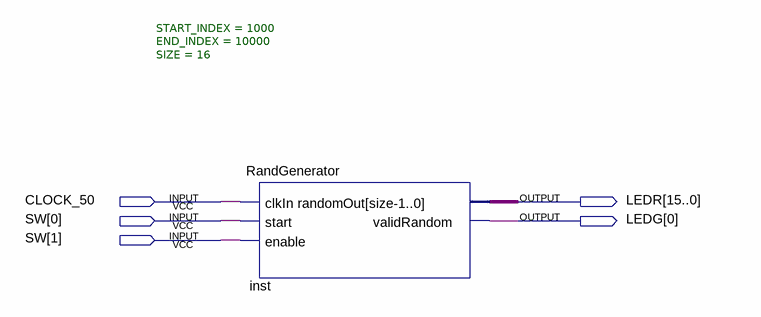
[diagram p0: schematic sheet]
// Quartus schematic RandGenerator_Test.bdf as structural Verilog: 1 symbols, 5 pins
module RandGenerator_Test (
  input  CLOCK_50,
  input  [1:0] SW,
  output [15:0] LEDR,
  output [0:0] LEDG
);

  RandGenerator #(.START_INDEX(1000), .END_INDEX(10000), .SIZE(16)) inst (
    .clkIn(CLOCK_50), .start(SW[0]), .enable(SW[1]), .randomOut(LEDR), .validRandom(LEDG[0]));
endmodule
